# EAGLE design DIY_OpenEVSE_PLUS_30A (EAGLE 6.2)
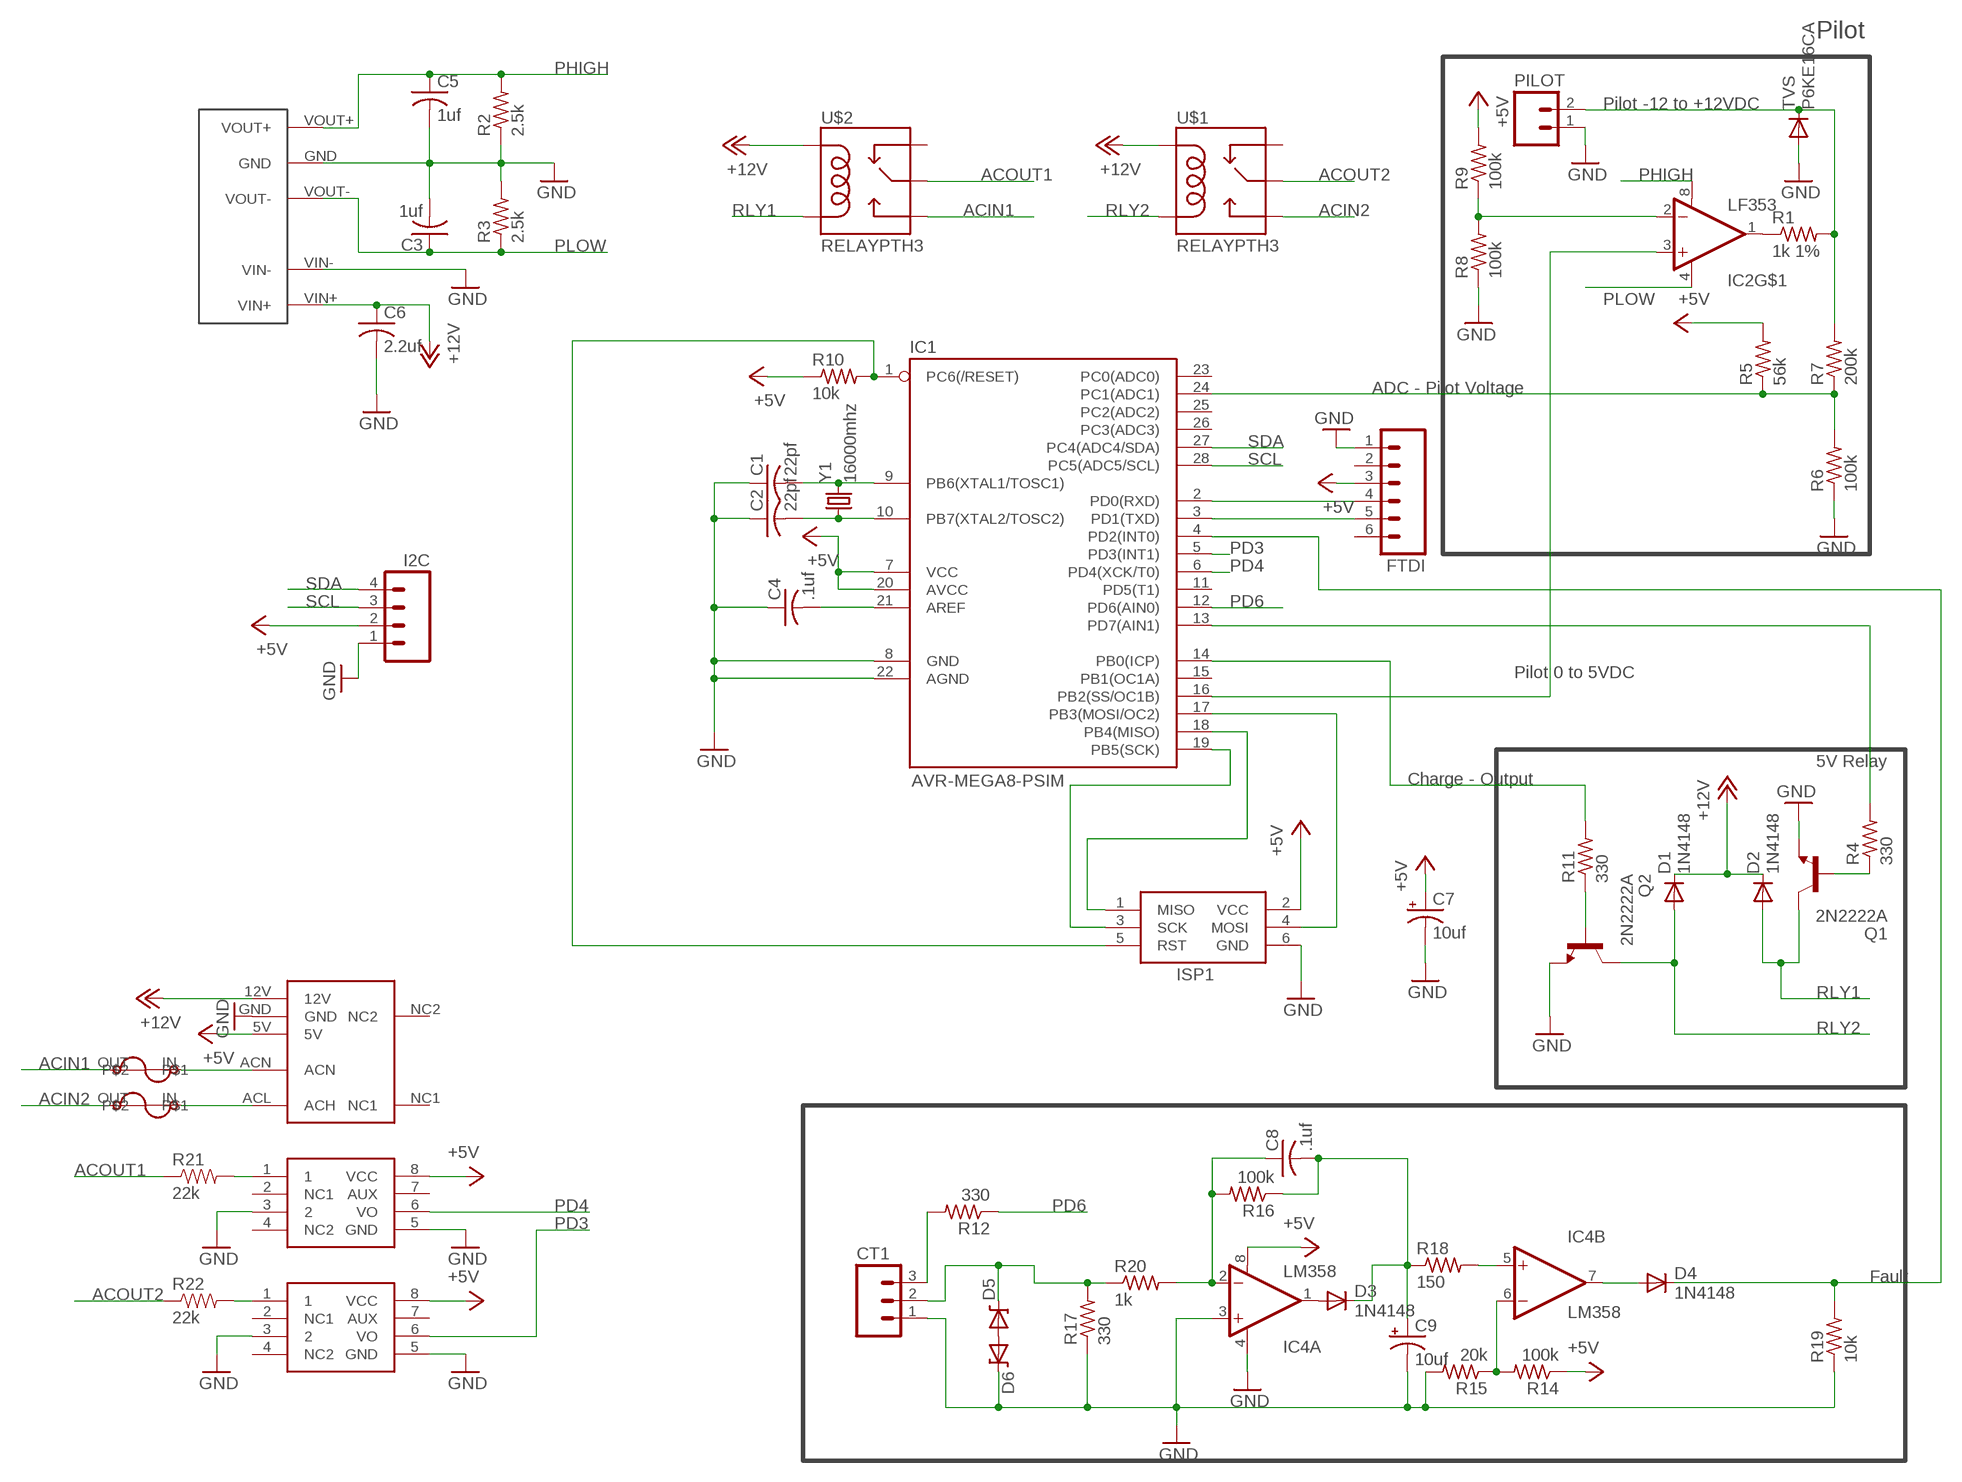
[diagram p0: schematic, sheet 1]

## Parts
C1  22pf  C-US025-024X044  [C025-024X044]
C2  22pf  C-US025-024X044  [C025-024X044]
C3  1uf  C-US025-024X044  [C025-024X044]
C4  .1uf  C-US025-024X044  [C025-024X044]
C5  1uf  C-US025-024X044  [C025-024X044]
C6  2.2uf  C-US025-024X044  [C025-024X044]
C7  10uf  CAP_POLPTH2  [CPOL-RADIAL-10UF-25V]
C8  .1uf  C-US025-024X044  [C025-024X044]
C9  10uf  CAP_POLPTH2  [CPOL-RADIAL-10UF-25V]
CT1  M03LOCK  [1X03_LOCK]
D1  1N4148  DIODE1N4148  [DIODE-1N4148]
D2  1N4148  DIODE1N4148  [DIODE-1N4148]
D3  1N4148  DIODE1N4148  [DIODE-1N4148]
D4  1N4148  DIODE1N4148  [DIODE-1N4148]
D5  DIODE-ZENERPTH  [DIODE-ZENER]
D6  DIODE-ZENERPTH  [DIODE-ZENER]
DCDC  D107E  DCDC_SIP  [DCDC_SIP]
FTDI  M06LOCK  [1X06_LOCK]
I2C  M04LOCK  [1X04_LOCK]
IC1  AVR-MEGA8-PSIM  [DIL28-3-SIMON]
IC2  LF353  LM358  [DIP08]
IC3  MID400  [DIP08]
IC4  LM358  OPAMP-DUALDIP  [DIP08]
IC5  MID400  [DIP08]
ISP1  AVRISP-6  [AVRISP]
PILOT  M025MM  [SCREWTERMINAL-5MM-2]
Q1  2N2222A  [TO18]
Q2  2N2222A  [TO18]
R1  1k 1%  R-US_0204/7  [0204/7]
R2  2.5k  R-US_0204/7  [0204/7]
R3  2.5k  R-US_0204/7  [0204/7]
R4  330  R-US_0204/7  [0204/7]
R5  56k  R-US_0204/7  [0204/7]
R6  100k  R-US_0204/7  [0204/7]
R7  200k  R-US_0204/7  [0204/7]
R8  100k  R-US_0204/7  [0204/7]
R9  100k  R-US_0204/7  [0204/7]
R10  10k  R-US_0204/7  [0204/7]
R11  330  R-US_0204/7  [0204/7]
R12  330  R-US_0204/7  [0204/7]
R14  100k  R-US_0204/7  [0204/7]
R15  20k  R-US_0204/7  [0204/7]
R16  100k  R-US_0204/7  [0204/7]
R17  330  R-US_0204/7  [0204/7]
R18  150  R-US_0204/7  [0204/7]
R19  10k  R-US_0204/7  [0204/7]
R20  1k  R-US_0204/7  [0204/7]
R21  22k  RESISTORPTH-1/4W  [AXIAL-0.4]
R22  22k  RESISTORPTH-1/4W  [AXIAL-0.4]
TVS  P6KE16CA  DIODEPTH  [DIODE-1N4001]
U$1  RELAYPTH3  [RELAY-T9A-2]
U$2  RELAYPTH3  [RELAY-T9A-2]
U$3  BEL1AFUSE  [BELFUSE1A]
U$4  MPM-04E-1205  [MPM-04E-1205]
U$5  BEL1AFUSE  [BELFUSE1A]
Y1  16000mhz  CRYSTALHC49UV  [HC49U-V]

## Nets
+5V: C7.1(+) FTDI.3 I2C.2 IC1.7(VCC) IC1.20(AVCC) IC3.8(VCC) IC4.8(A:V+) IC5.8(VCC) ISP1.2(VCC) R5.2 R9.2 R10.1 R14.1 U$4.5V
+12V: C6.1 D1.C D2.C DCDC.VIN+ U$1.COIL1 U$2.COIL1 U$4.12V
ACIN1: U$2.NO U$5.OUT
ACIN2: U$1.NO U$3.OUT
ACOUT1: R21.P$1 U$2.MAIN
ACOUT2: R22.P$1 U$1.MAIN
GND: C1.1 C2.1 C3.2 C4.1 C5.2 C6.2 C7.2(-) C9.2(-) CT1.1 D6.P$1(C) DCDC.GND DCDC.VIN- FTDI.1 I2C.1 IC1.8(GND) IC1.22(AGND) IC3.3 IC3.5(GND) IC4.3(A:+IN) IC4.4(A:V-) IC5.3 IC5.5(GND) ISP1.6(GND) PILOT.1 Q1.1(E) Q2.1(E) R2.1 R3.2 R6.1 R8.1 R15.2 R17.1 R19.1 TVS.A U$4.GND
N$1: CT1.3 R12.2
N$2: Q2.2(B) R11.1
N$3: PILOT.2 R1.2 R7.2 TVS.C
N$4: C1.2 IC1.9(PB6(XTAL1/TOSC1)) Y1.2
N$5: C2.2 IC1.10(PB7(XTAL2/TOSC2)) Y1.1
N$7: C4.2 IC1.21(AREF)
N$8: FTDI.5 IC1.3(PD1(TXD))
N$9: IC3.1 R21.P$2
N$10: IC2.2(-IN) R8.2 R9.1
N$11: IC2.1(OUT) R1.1
N$12: FTDI.4 IC1.2(PD0(RXD))
N$14: IC1.17(PB3(MOSI/OC2)) ISP1.4(MOSI)
N$15: IC1.19(PB5(SCK)) ISP1.3(SCK)
N$16: IC1.18(PB4(MISO)) ISP1.1(MISO)
N$17: IC5.1 R22.P$2
N$18: C8.1 IC4.2(A:-IN) R16.2 R20.2
N$19: IC4.5(B:+IN) R18.2
N$20: CT1.2 D5.P$1(C) R17.2 R20.1
N$21: D3.A IC4.1(A:OUT)
N$22: D5.P$2(A) D6.P$2(A)
N$23: C8.2 C9.1(+) D3.C R16.1 R18.1
N$24: IC4.6(B:-IN) R14.2 R15.1
N$25: D4.A IC4.7(B:OUT)
N$27: U$3.IN U$4.ACL(ACH)
N$28: D4.C IC1.4(PD2(INT0)) R19.2
N$30: U$4.ACN U$5.IN
N$31: Q1.2(B) R4.1
N$33: IC1.13(PD7(AIN1)) R4.2
N$34: IC1.14(PB0(ICP)) R11.2
N$53: IC1.24(PC1(ADC1)) R5.1 R6.2 R7.1
PD3: IC1.5(PD3(INT1)) IC5.6(VO)
PD4: IC1.6(PD4(XCK/T0)) IC3.6(VO)
PD6: IC1.12(PD6(AIN0)) R12.1
PHIGH: C5.1 DCDC.VOUT+ IC2.8(V+) R2.2
PLOW: C3.1 DCDC.VOUT- IC2.4(V-) R3.1
RLY1: D2.A Q1.3(C) U$2.COIL2
RLY2: D1.A Q2.3(C) U$1.COIL2
RST: IC1.1(PC6(/RESET)) ISP1.5(RST) R10.2
S$2: IC1.16(PB2(SS/OC1B)) IC2.3(+IN)
SCL: I2C.3 IC1.28(PC5(ADC5/SCL))
SDA: I2C.4 IC1.27(PC4(ADC4/SDA))
Unconnected: FTDI.2 FTDI.6 IC1.11(PD5(T1)) IC1.15(PB1(OC1A)) IC1.23(PC0(ADC0)) IC1.25(PC2(ADC2)) IC1.26(PC3(ADC3)) IC2.5(+IN) IC2.6(-IN) IC2.7(OUT) IC3.2(NC1) IC3.4(NC2) IC3.7(AUX) IC5.2(NC1) IC5.4(NC2) IC5.7(AUX) U$1.NC U$2.NC U$4.NC1 U$4.NC2

## Notes on the sheet
- Pilot
- Pilot -12 to +12VDC
- ADC - Pilot Voltage
- Pilot 0 to 5VDC
- 5V Relay
- Charge - Output
- Fault

## Library data of the parts
C1-C6 C8 = adafruit:C-US: CAPACITOR, American symbol
C7 C9 = SparkFun:CAP_POL: Capacitor Polarized These are standard SMD and PTH capacitors. Normally 10uF, 47uF, and 100uF in electrolytic and tantalum varieties. Always verify the external diameter of the through hole cap, it varies with capacity, voltage, and manufacturer. The EIA devices should be standard.
CT1 = SparkFun:M03: Header 3 Standard 3-pin 0.1" header. Use with straight break away headers (SKU : PRT-00116), right angle break away headers (PRT-00553), swiss pins (PRT-00743), machine pins (PRT-00117), and female headers (PRT-00115). Molex polarized connector foot print use with SKU : PRT-08232 with associated crimp pins and housings.
D1-D4 TVS = SparkFun:DIODE: Diode These are standard reverse protection diodes and small signal diodes. SMA package can handle up to about 1A. SOD-323 can handle about 200mA. What the SOD-323 package when ordering, there are some mfgs out there that are 5-pin packages.
D5 D6 = SparkFun:DIODE-ZENER: Zener Diode Production Part - 8199 3.4V Zener Voltage
DCDC = Qxd:DCDC_SIP
FTDI = SparkFun:M06: Header 6 Standard 6-pin 0.1" header. Use with straight break away headers (SKU : PRT-00116), right angle break away headers (PRT-00553), swiss pins (PRT-00743), machine pins (PRT-00117), and female headers (PRT-00115). Molex polarized connector foot print use with SKU : PRT-08094 with associated crimp pins and housings. NOTES ON THE VARIANTS LOCK and LOCK_LONGPADS... This footprint was designed to help hold the alignment of a through-hole component (i.e. 6-pin header) while soldering it into place. You may notice that each hole has been shifted either up or down by 0.005 of an inch from it's more standard position (which is a perfectly straight line). This slight alteration caused the pins (the squares in the middle) to touch the edges of the holes. Because they are alternating, it causes a "brace" to hold the component in place. 0.005 has proven to be the perfect amount of "off-center" position when using our standard breakaway headers. Although looks a little odd when you look at the bare footprint, once you have a header in there, the alteration is very hard to notice. Also, if you push a header all the way into place, it is covered up entirely on the bottom side. This idea of altering the position of holes to aid alignment will be further integrated into the Sparkfun Library for other footprints. It can help hold any component with 3 or more connection pins.
I2C = SparkFun:M04: Header 4 Standard 4-pin 0.1" header. Use with straight break away headers (SKU : PRT-00116), right angle break away headers (PRT-00553), swiss pins (PRT-00743), machine pins (PRT-00117), and female headers (PRT-00115). Molex polarized connector foot print use with SKU : PRT-08231 with associated crimp pins and housings.
IC1 = SparkFun:AVR-MEGA8-P: MICROCONTROLLER 8 Kbytes FLASH 1 kbytes SRAM 512 bytes EEPROM USART 4-channel 10 bit ADC 2-channel 8 bit ADC
IC2 = SparkFun:LM358
IC3 IC5 = SparkFun:MID400
IC4 = SparkFun:OPAMP-DUAL: Operational Amplifier
ISP1 = adafruit:AVRISP: AVR ISP HEADER Standard 6 pin header for AVR programming
PILOT = SparkFun:M02: Header 2 Standard 2-pin 0.1" header. Use with straight break away headers (SKU : PRT-00116), right angle break away headers (PRT-00553), swiss pins (PRT-00743), machine pins (PRT-00117), and female headers (PRT-00115). Molex polarized connector foot print use with SKU : PRT-08233 with associated crimp pins and housings.
Q1 Q2 = transistor-npn:2N2222*: NPN Transistor
R1-R12 R14-R20 = adafruit:R-US_: RESISTOR, American symbol
R21 R22 = SparkFun:RESISTOR: Resistor Basic schematic elements and footprints for 0603, 1206, and PTH resistors.
U$1 U$2 = SparkFun:RELAY
U$3 U$5 = Qxd:BEL1AFUSE
U$4 = Qxd:MPM-04E-1205
Y1 = SparkFun:CRYSTAL: Crystals Various standard crystals. Proven footprints. Spark Fun Electronics SKU : COM-00534

## Board
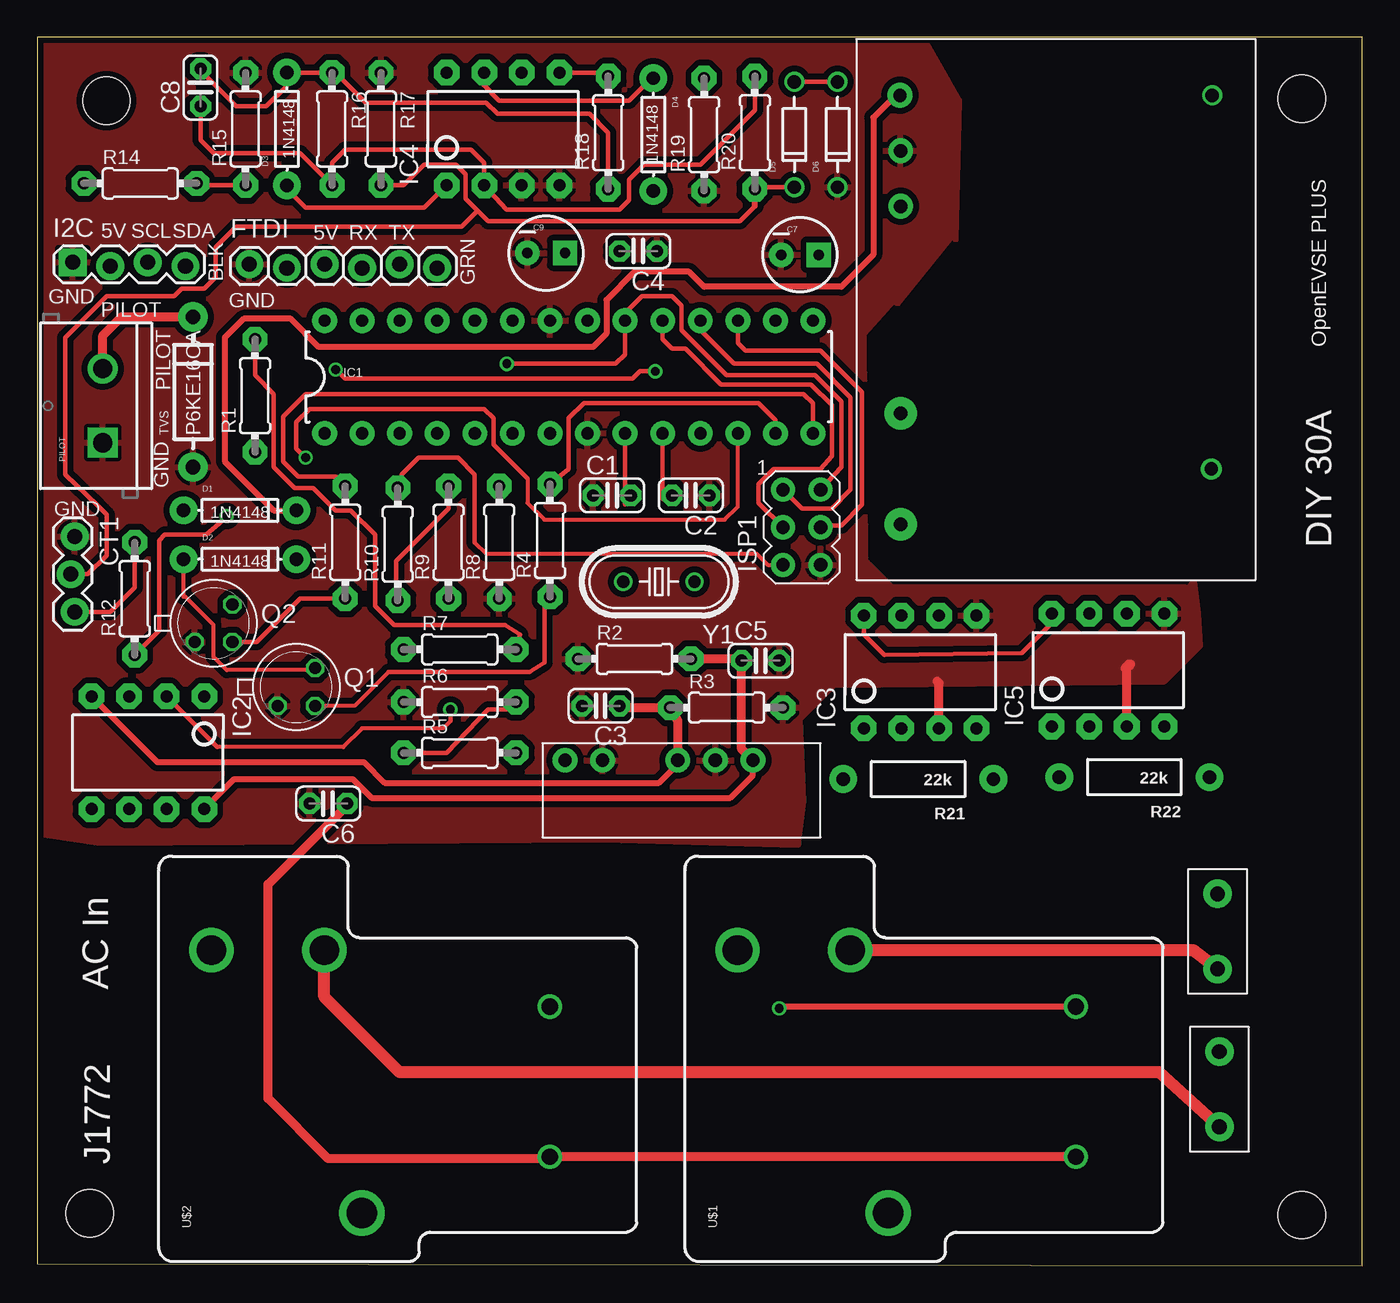
[diagram p1: board, top side]
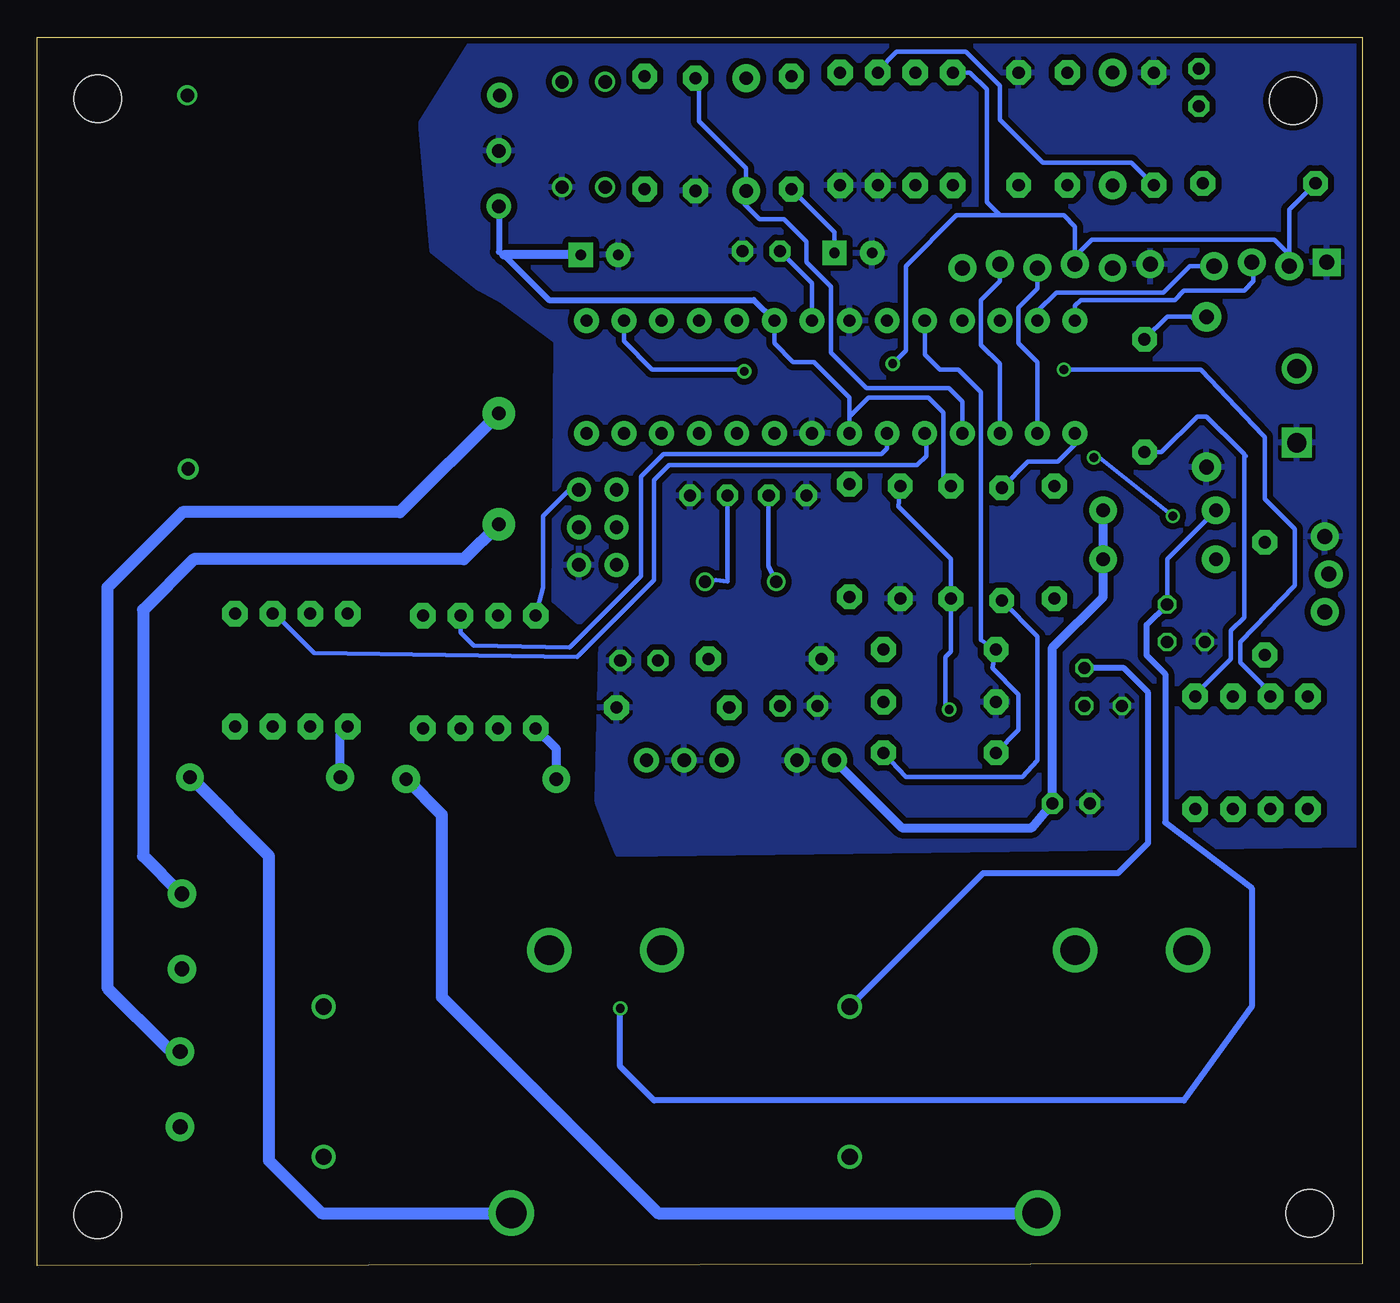
[diagram p2: board, bottom side, seen from below]

Size 89.59 x 83.05 mm. Coordinates in mm from the lower left corner, seen from the top.
Outline: 0,0.13 89.59,0 89.59,83.05 0,83.05 0,0.13
Copper layers (1*16): Top 0.0356mm / dielectric 1.5011mm / Bottom 0.0356mm
Design rules: minimum track width 6mil, minimum drill 13mil, track to track 6mil, track to pad 6mil, pad to pad 6mil, via to via 6mil, smd to smd 6mil, copper to edge 15mil, drill to drill 6mil, minimum pad ring 7mil, minimum via ring 7mil, stop-mask expansion 4mil, vias tented up to drill 0mil, thermal gap 10mil
Holes 3.2 mm at 4.7,78.74 3.56,3.56 85.47,3.43 85.47,78.87

### Footprints (pad centres in the part's own frame; a part is rotated, then mirrored left to right if it is on the bottom)
C025-024X044 = drill 0.813 pad 1.422 octagon: 1 -1.27,0; 2 1.27,0
CPOL-RADIAL-10UF-25V = drill 0.7 pad 1.651 square: 1 1.27,0 | drill 0.7 pad 1.651: 2 -1.27,0
1X03_LOCK = drill 1.016 pad 1.88: 1 0,0.127; 2 2.54,-0.127; 3 5.08,0.127
DIODE-1N4148 = drill 0.9 pad 1.88: A -3.81,0; C 3.81,0
DIODE-ZENER = drill 0.9: P$1 -3.556,0; P$2 3.556,0
DCDC_SIP = drill 0.9 pad 1.676: GND 10.16,0; VIN+ 0,0; VIN- 2.54,0; VOUT+ 12.7,0; VOUT- 7.62,0
1X06_LOCK = drill 1.016 pad 1.88: 1 0,0; 2 2.54,-0.254; 3 5.08,0; 4 7.62,-0.254; 5 10.16,0; 6 12.7,-0.254
1X04_LOCK = drill 1.016 pad 1.88 square: 1 0,0.127 | drill 1.016 pad 1.88: 2 2.54,-0.127; 3 5.08,0.127; 4 7.62,-0.127
DIL28-3-SIMON = drill 0.813 pad 1.676: 1 -16.51,-3.81; 2 -13.97,-3.81; 3 -11.43,-3.81; 4 -8.89,-3.81; 5 -6.35,-3.81; 6 -3.81,-3.81; 7 -1.27,-3.81; 8 1.27,-3.81; 9 3.81,-3.81; 10 6.35,-3.81; 11 8.89,-3.81; 12 11.43,-3.81; 13 13.97,-3.81; 14 16.51,-3.81; 15 16.51,3.81; 16 13.97,3.81; 17 11.43,3.81; 18 8.89,3.81; 19 6.35,3.81; 20 3.81,3.81; 21 1.27,3.81; 22 -1.27,3.81; 23 -3.81,3.81; 24 -6.35,3.81; 25 -8.89,3.81; 26 -11.43,3.81; 27 -13.97,3.81; 28 -16.51,3.81
DIP08 = drill 0.813 pad 1.727 octagon: 1 -3.81,-3.81; 2 -1.27,-3.81; 3 1.27,-3.81; 4 3.81,-3.81; 5 3.81,3.81; 6 1.27,3.81; 7 -1.27,3.81; 8 -3.81,3.81
AVRISP = drill 0.9 pad 1.626: 1 -1.27,2.54; 2 1.27,2.54; 3 -1.27,0; 4 1.27,0; 5 -1.27,-2.54; 6 1.27,-2.54
SCREWTERMINAL-5MM-2 = drill 1.3 pad 2.032 square: 1 0,0 | drill 1.3 pad 2.032: 2 5,0
TO18 = drill 0.813 octagon: 1 -1.27,-1.27; 2 1.27,-1.27; 3 1.27,1.27
0204/7 = drill 0.813 pad 1.676 octagon: 1 -3.81,0; 2 3.81,0
AXIAL-0.4 = drill 0.9 pad 1.88: P$1 -5.08,0; P$2 5.08,0
DIODE-1N4001 = drill 1 pad 1.981: A -5.08,0; C 5.08,0
RELAY-T9A-2 = drill 1.1: COIL1 -6.61,-10.27; COIL2 3.55,-10.27 | drill 2.057: MAIN -10.41,2.43 | drill 2: NC 7.35,12.6; NO 7.35,4.97
BELFUSE1A = drill 1 pad 1.93: IN 2,1.66; OUT 2,6.74
MPM-04E-1205 = drill 0.9 pad 1.676: 5V 3,25.25; 12V 2.95,32.75; GND 3,29 | drill 0.9 pad 2.184: ACL 3,3.75; ACN 3,11.25 | drill 0.9 pad 1.422: NC1 24,7.5 | drill 0.9: NC2 24.05,32.75
HC49U-V = drill 0.813: 1 -2.413,0; 2 2.413,0

### Placement (x,y rotation side)
C1  38.86,52.07 0 top
C2  44.2,52.07 180 top
C3  38.1,37.85 180 top
C4  40.64,68.58 180 top
C5  48.9,40.89 0 top
C6  19.68,31.24 180 top
C7  51.56,68.33 0 top
C8  11.05,79.63 90 top
C9  34.42,68.45 0 top
CT1  2.41,49.28 270 top
D1  13.72,51.05 0 top
D2  13.72,47.75 0 top
D3  16.89,76.84 90 top
D4  41.66,76.45 270 top
D5  51.18,76.45 90 top
D6  54.1,76.45 90 top
DCDC  35.69,34.16 0 top
FTDI  14.35,67.69 0 top
I2C  2.41,67.69 0 top
IC1  35.94,60.07 0 top
IC2  7.49,34.67 180 top
IC3  59.69,40.13 0 top
IC4  31.5,76.84 0 top
IC5  72.39,40.26 0 top
ISP1  51.69,49.91 0 top
PILOT  4.45,55.63 90 top
Q1  17.53,39.12 0 top
Q2  11.94,43.43 0 top
R1  14.73,58.8 90 top
R2  40.39,41.02 0 top
R3  46.61,37.72 0 top
R4  34.67,49.02 90 top
R5  28.57,34.67 0 top
R6  28.57,38.1 0 top
R7  28.57,41.66 0 top
R8  31.24,48.89 90 top
R9  27.81,48.89 90 top
R10  24.38,48.77 90 top
R11  20.83,48.89 90 top
R12  6.6,45.09 90 top
R14  6.99,73.15 0 top
R15  14.1,76.84 90 top
R16  19.94,76.84 270 top
R17  23.24,76.84 270 top
R18  38.61,76.58 90 top
R19  45.09,76.45 90 top
R20  48.51,76.58 90 top
R21  59.56,32.89 180 top
R22  74.17,33.02 180 top
TVS  10.54,59.05 90 top
U$1  59.94,13.97 90 top
U$2  24.38,13.97 90 top
U$3  81.79,26.8 180 top
U$4  55.37,46.35 0 top
U$5  81.91,16.13 180 top
Y1  42.04,46.23 180 top

### Tracks (layer width: path | path; a pad name or v marks a point on that pad's centre or on a via)
+5V  (via drill 0.6)
  Top 0.305: IC5.8 68.58,43.43 66.55,41.4 57.28,41.27 55.88,42.67 IC3.8 | ISP1.2 54.36,53.97 54.36,58.42 52.58,60.2 46.61,60.2 43.56,63.25 43.56,64.9 42.93,65.53 40.89,65.53 39.75,64.39 IC1.20 39.75,61.59 39.12,60.96 v31.75,60.96 | R9.2 27.81,51.18 24.26,47.62 24.26,45.09 R10.1 24.51,44.96
  Bottom 0.305: IC1.7 34.67,57.4 | 34.67,57.4 34.67,58.67 37.08,61.09 38.48,61.09 39.75,62.36 IC1.20 | R14.1 4.95,71.37 I2C.2 4.95,68.33 5.97,69.34 18.29,69.34 19.43,68.2 | R9.2 28.32,53.21 28.32,57.66 29.34,58.67 33.4,58.67 34.67,57.4 | FTDI.3 19.43,68.2 | 19.43,68.2 19.43,70.23 20.19,70.99 24.51,70.99 | 24.51,70.99 25.4,71.88 25.4,79.5 26.54,80.65 IC4.8 | ISP1.2 53.59,52.45 55.37,50.67 55.37,45.85 IC3.8 | R5.2 30.86,33.02 22.99,33.02 21.97,34.16 21.97,42.54 R10.1 | 24.51,70.99 27.43,70.99 30.86,67.56 30.86,61.85 v31.75,60.96
  Bottom 0.406: U$4.5V 58.37,68.53 58.04,68.33 54.99,65.28 41.15,65.28 IC1.20
  Bottom 0.61: C7.1 58.04,68.33
+12V
  Top 0.406: U$4.12V 58.28,79.36 56.52,77.6 56.52,68.33 54.36,66.17 45.09,66.17 44.07,67.18 40.39,67.18 38.48,65.28 38.48,62.99 37.59,62.1 19.05,62.1 17.14,64.01 13.97,64.01 12.7,62.74 12.7,54.36 16,51.05 D1.C
  Top 0.61: U$1.COIL1 U$2.COIL1 34.53,7.24 19.68,7.24 15.62,11.3 15.62,25.78 20.95,31.12 C6.1
  Bottom 0.61: D1.C D2.C 17.53,45.21 20.95,41.78 C6.1 22.35,29.59 31.11,29.59 DCDC.VIN+
ACIN1
  Top 0.813: U$5.OUT 75.84,13.08 24.51,13.08 19.41,18.18 U$2.NO
ACIN2
  Top 0.813: U$3.OUT 78.14,21.32 U$1.NO
ACOUT1
  Bottom 0.813: R21.P$1 62.23,30.48 62.23,18.16 47.63,3.56 U$2.MAIN
ACOUT2
  Bottom 0.813: R22.P$1 73.91,27.69 73.91,7.11 70.36,3.56 U$1.MAIN
GND
  Top 0.61: IC5.3 73.66,40.39 73.91,40.64 73.79,40.64 73.53,40.39 | IC3.3 60.96,39.37 60.83,39.5
  pour Bottom (isolate 0.406): 0.13,28.45 50.29,27.81 50.55,28.45 51.69,31.37 51.44,42.16 54.61,44.96 54.48,62.48 58.04,65.15 59.69,66.04 62.87,68.58 63.63,77.22 58.8,84.96 -3.3,87
  pour Top (isolate 0.406): 4.32,28.58 38.23,28.83 51.44,28.45 51.82,31.37 51.56,36.96 53.85,39.24 76.2,39.5 78.61,41.91 78.49,44.07 78.23,46.23 77.72,45.72 77.6,45.85 57.79,45.85 56.01,47.62 55.88,62.99 57.91,65.28 58.17,65.02 61.85,69.6 62.1,69.34 62.36,78.74 59.31,84.07 -1.14,84.84 0,29.21
N$1
  Top 0.305: CT1.3 4.95,44.2 6.6,45.85 R12.2
N$2
  Top 0.305: R11.1 17.78,45.09 14.86,42.16 Q2.2
N$3
  Top 0.305: R7.2 32.64,42.67 31.62,43.31 24.13,43.31 22.86,44.58 22.86,49.4 21.21,51.05 20.19,51.05 18.67,52.58 17.4,52.58 16,53.97 16,58.93 14.73,60.2 R1.2
  Top 0.61: PILOT.2 4.45,62.86 5.71,64.14 TVS.C
  Bottom 0.305: R1.2 13.21,64.14 11.56,64.14 11.43,64.01 10.67,64.01 TVS.C
N$4
  Top 0.305: IC1.9 39.75,51.43 C1.2
  Bottom 0.305: C1.2 40.13,47.24 Y1.2
N$5
  Top 0.305: IC1.10 42.29,51.82 C2.2
  Bottom 0.305: Y1.1 43.69,46.35 42.93,46.23 C2.2
N$7
  Bottom 0.305: IC1.21 37.21,66.42 C4.2
N$8
  Bottom 0.305: FTDI.5 24.51,66.55 25.78,65.28 25.78,62.23 24.51,60.96 IC1.3
N$9
  Bottom 0.61: R21.P$2 54.48,34.92 IC3.1
N$10  (via drill 0.6)
  Top 0.254: 27.94,36.83 27.43,36.32 21.97,36.32 20.7,35.05 12.19,35.05
  Top 0.305: v27.94,37.59 27.94,36.83 | 12.19,35.05 IC2.2
  Bottom 0.305: R8.2 31.37,51.31 27.81,47.75 R9.1 27.81,41.53 28.19,41.15 28.19,37.59 v27.94,37.59
N$11
  Bottom 0.305: R1.1 13.59,54.99 11.18,57.4 10.54,57.4 8.26,55.12 8,54.86 | 8,54.86 7.87,54.74 | IC2.1 11.3,38.61 8.89,41.02 8.89,42.93 8,43.81 8,54.86
N$12
  Bottom 0.305: FTDI.4 21.97,66.04 23.24,64.77 23.24,62.36 21.97,61.09 IC1.2
N$14
  Top 0.305: IC1.17 47.37,62.36 47.88,61.85 52.96,61.85 55.75,59.05 55.75,51.43 54.36,50.04 53.09,50.04 ISP1.4
N$15
  Top 0.305: IC1.19 42.29,62.61 42.93,61.98 43.82,61.98 46.23,59.56 52.32,59.56 53.72,58.17 53.72,54.74 52.96,53.85 49.78,53.85 48.77,52.83 48.77,51.56 ISP1.3
N$16
  Top 0.305: IC1.18 44.83,63.25 47.12,60.96 52.71,60.96 54.99,58.67 54.99,52.45 53.72,51.18 51.69,51.18 ISP1.1
N$17
  Bottom 0.61: R22.P$2 69.09,35.94 IC5.1
N$18
  Top 0.305: C8.1 11.05,76.07 11.94,75.18 17.78,75.18 R16.2 19.94,74.55 20.83,75.44 29.34,75.44 30.23,74.55 IC4.2 31.75,71.37 39.37,71.37 40.01,72.01 40.01,73.41 41.02,74.42 44.83,74.42 48.51,78.11 R20.2
N$19
  Top 0.305: IC4.5 38.35,80.65 R18.2
N$20
  Top 0.305: 51.61,72.85 D5.P$1 48.64,72.9 | R17.2 24.76,73.03 26.16,74.42 28.32,74.42 28.96,73.79 28.96,72.14 29.78,71.31 | 29.78,71.31 30.48,70.61 47.5,70.61 48.51,71.63 | 4.45,51.05 4.12,51.37 | 4.12,51.37 1.91,53.47 1.91,62.74 4.7,65.53 9.27,65.53 9.78,66.04 11.3,66.04 12.06,66.8 12.06,68.83 13.46,70.23 28.7,70.23 29.78,71.31 | CT1.2 3.43,46.74 4.7,48.01 4.7,50.78 4.12,51.37
  Top 0.406: 48.51,71.63 R20.1 48.64,72.9
N$21
  Top 0.305: D3.A 16.89,72.77 18.16,71.5 26.16,71.5 IC4.1
N$22
  Top 0.305: D5.P$2 D6.P$2
N$23
  Top 0.305: C8.2 11.05,80.77 13.46,78.36 15.49,78.36 16.89,79.76 D3.C R16.1 20.19,80.65 22.22,78.61 30.35,78.61 31.11,77.85 37.34,77.85 38.61,76.58 R18.1
  Bottom 0.305: C9.1 35.69,69.85 R18.1
N$24
  Top 0.305: R15.1 10.92,73.03 R14.2
  Bottom 0.305: IC4.6 32.77,80.77 31.5,82.04 26.8,82.04 24.51,79.76 24.51,77.47 21.59,74.55 15.62,74.55 R15.1
N$25
  Top 0.305: D4.A 41.53,80.26 40.01,78.74 31.24,78.74 30.1,79.88 30.1,80.52 IC4.7
N$27
  Bottom 0.813: U$4.ACL 60.73,47.75 78.99,47.75 82.42,44.32 82.42,27.69 79.87,25.14 U$3.IN
N$28
  Bottom 0.305: IC1.4 27.05,58.42 27.94,59.31 33.53,59.31 35.94,61.72 35.94,66.17 37.59,67.82 37.59,69.22 39.12,70.74 40.77,70.74 41.78,71.76 41.78,72.52 D4.C 41.66,74.17 44.83,77.34 44.83,80.01 R19.2
N$30
  Bottom 0.813: U$4.ACN 65.05,50.93 79.76,50.93 84.84,45.85 84.84,18.8 80.76,14.72 U$5.IN
N$31
  Top 0.254: 23.75,40.13 21.46,37.85 Q1.2
  Top 0.305: 23.75,40.13 33.27,40.13 34.29,40.77 34.29,44.58 R4.1
N$33
  Top 0.305: IC1.13 49.91,57.15 48.77,58.29 36.96,58.29 35.94,57.28 35.94,53.85 R4.2
N$34
  Top 0.305: IC1.14 52.45,58.29 51.82,58.93 18.16,58.93 16.64,57.4 16.64,54.36 17.65,53.34 20.19,53.34 R11.2
N$53
  Top 0.305: R5.1 27.69,34.67 30.48,37.59 31.75,37.59 R6.2
  Bottom 0.305: IC1.24 29.59,61.59 28.57,60.58 27.3,60.58 25.78,59.05 25.78,42.29 R7.1 25.02,40.39 23.24,38.61 23.24,36.2 R5.1
PD3
  Bottom 0.305: IC5.6 73.53,44.07 70.87,41.4 53.09,41.15 47.88,46.35 47.88,53.09 46.86,54.1 30.1,54.1 29.46,54.74 29.46,56.13 IC1.5
PD4
  Bottom 0.305: IC3.6 60.96,42.8 60.07,41.91 53.59,41.78 48.77,46.61 48.77,53.34 47.24,54.86 32.51,54.86 32.13,55.24 IC1.6
PD6  (via drill 0.6)
  Top 0.254: 33.15,53.21 33.15,51.56 34.29,50.42 46.48,50.42 47.37,51.31 IC1.12
  Top 0.305: 33.15,53.21 30.86,55.5 30.86,57.28 30.23,57.91 18.41,57.91 17.53,57.02 17.53,55.24 v18.16,54.61 | v12.83,50.67 12.32,50.16 11.43,49.4 8.64,49.4 8.26,49.02 8.26,42.93 R12.1
  Bottom 0.305: v18.16,54.61 17.78,54.61 v12.83,50.67
PHIGH
  Top 0.406: IC2.8 13.34,32.89 21.34,32.89 22.61,31.62 46.86,31.62 48.39,33.15 DCDC.VOUT+
  Top 0.61: DCDC.VOUT+ 47.62,34.92 C5.1 47.5,41.02 R2.2
PLOW
  Top 0.406: IC2.4 8.13,34.04 22.1,34.04 23.49,32.64 42.04,32.64 43.31,33.91 DCDC.VOUT-
  Top 0.61: DCDC.VOUT- 43.31,36.83 R3.1 39.5,37.72 C3.1
RLY1
  Top 0.254: Q1.3 18.54,40.26 12.83,40.26 11.94,41.15 11.94,43.31 10.03,45.21 9.91,45.21 D2.A
  Bottom 0.406: U$2.COIL2 25.63,26.54 16.51,26.54 14.48,28.58 14.48,38.73 16.13,40.39 Q1.3
RLY2  (via drill 0.6)
  Top 0.406: v50.16,17.4 50.29,17.52 U$1.COIL2
  Bottom 0.305: Q2.3 13.21,47.75 D1.A
  Bottom 0.406: Q2.3 14.61,43.31 14.61,41.27 13.34,40 13.34,29.97 7.49,25.53 7.49,17.53 12.06,11.18 47.88,11.18 50.16,13.46 v50.16,17.4
RST
  Top 0.254: 29.59,48.89 30.35,48.13 48.64,48.13 49.4,47.37 ISP1.5
  Top 0.305: 29.59,48.89 29.59,53.47 28.45,54.61 25.78,54.61 24.64,53.47 24.64,52.83 R10.2
  Bottom 0.305: IC1.1 19.43,55.5 20.57,54.36 22.61,54.36 R10.2
S$2  (via drill 0.6)
  Top 0.305: v41.78,60.45 40.77,60.45 40.26,59.94 20.83,59.94 v20.19,60.58
  Bottom 0.305: IC1.16 49.91,62.48 48.01,60.58 41.91,60.58 v41.78,60.45 | v20.19,60.58 10.92,60.58 6.73,56.13 6.6,56.01 6.6,51.82 4.57,49.78 4.57,45.97 8.26,42.16 8.26,40.77 6.73,39.24 6.73,38.73 IC2.3
SCL
  Bottom 0.305: IC1.28 19.43,64.9 19.05,65.28 12.7,65.28 12.06,65.91 8,65.91 7.37,66.55 7.37,67.69 I2C.3
SDA
  Bottom 0.305: IC1.27 21.97,64.52 20.7,65.79 13.46,65.79 11.68,67.56 I2C.4

### Text on the board
tPlace: OpenEVSE PLUS | DIY 30A
tNames: 5V | SCL | SDA | 5V | RX | TX | BLK | GRN | GND | GND | PILOT | PILOT | GND | GND | AC In | J1772